# Altium schematic sheet PS2_Echo.SchDoc
size A4
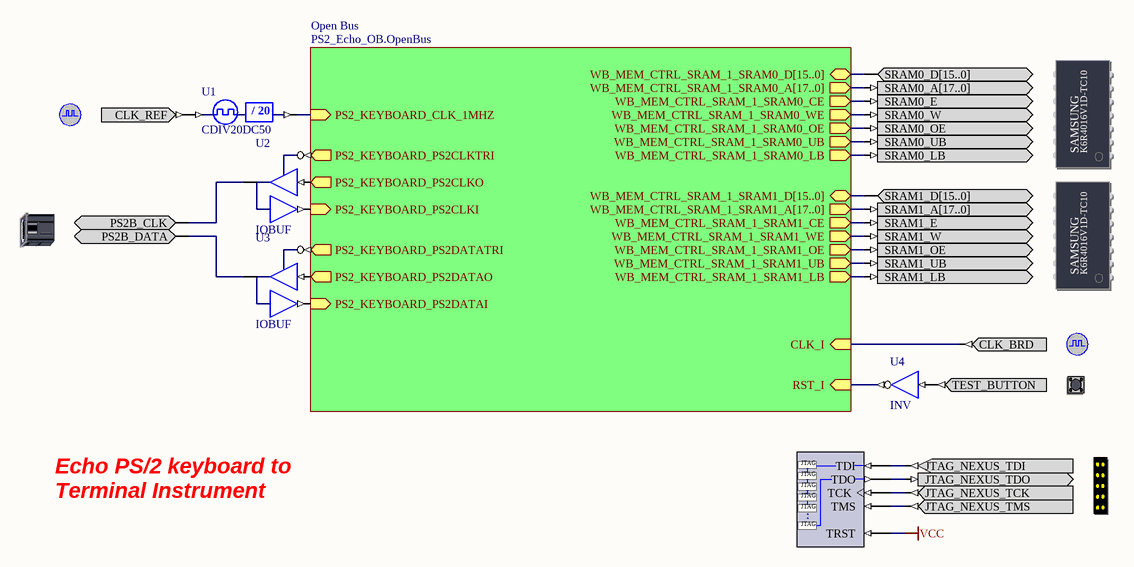
[diagram p0: PS2_Echo.SchDoc]

## Parts
(Parts that share a designator on the sheet are numbered #1, #2 ... from top to bottom, then left to right.)
?#1  SRAM_DAUGHTER0  (value not drawn)
?#2  CLOCK_REFERENCE  (value not drawn)
?#3  SRAM_DAUGHTER1  (value not drawn)
?#4  PS2B  (value not drawn)
?#5  CLOCK_BOARD  (value not drawn)
?#6  TEST_BUTTON  (value not drawn)
?#7  NEXUS_JTAG_CONNECTOR  (value not drawn)
NEXUS_JTAG_PORT  NEXUS_JTAG_PORT  (value not drawn)
U1  CDIV20DC50
U2  IOBUF
U3  IOBUF
U4  INV

## Sub-sheets
Open Bus = PS2_Echo_OB.OpenBus: WB_MEM_CTRL_SRAM_1_SRAM0_OE (out), WB_MEM_CTRL_SRAM_1_SRAM0_A[17..0] (out), WB_MEM_CTRL_SRAM_1_SRAM0_WE (out), WB_MEM_CTRL_SRAM_1_SRAM0_D[15..0] (bidir), WB_MEM_CTRL_SRAM_1_SRAM0_CE (out), WB_MEM_CTRL_SRAM_1_SRAM0_UB (out), WB_MEM_CTRL_SRAM_1_SRAM0_LB (out), WB_MEM_CTRL_SRAM_1_SRAM1_WE (out), WB_MEM_CTRL_SRAM_1_SRAM1_UB (out), WB_MEM_CTRL_SRAM_1_SRAM1_A[17..0] (out), WB_MEM_CTRL_SRAM_1_SRAM1_OE (out), WB_MEM_CTRL_SRAM_1_SRAM1_LB (out), WB_MEM_CTRL_SRAM_1_SRAM1_CE (out), WB_MEM_CTRL_SRAM_1_SRAM1_D[15..0] (bidir), RST_I (in), CLK_I (in), PS2_KEYBOARD_PS2CLKTRI (out), PS2_KEYBOARD_PS2DATAI (in), PS2_KEYBOARD_CLK_1MHZ (in), PS2_KEYBOARD_PS2DATAO (out), PS2_KEYBOARD_PS2CLKO (out), PS2_KEYBOARD_PS2CLKI (in), PS2_KEYBOARD_PS2DATATRI (out)

## Nets
VCC: NEXUS_JTAG_PORT.TRST
Net?#1_SRAM0_A[17..0]: ?#1.SRAM0_A[17..0] ; sheet Open Bus/WB_MEM_CTRL_SRAM_1_SRAM0_A[17..0]
Net?#1_SRAM0_D[15..0]: ?#1.SRAM0_D[15..0] ; sheet Open Bus/WB_MEM_CTRL_SRAM_1_SRAM0_D[15..0]
Net?#1_SRAM0_E: ?#1.SRAM0_E ; sheet Open Bus/WB_MEM_CTRL_SRAM_1_SRAM0_CE
Net?#1_SRAM0_LB: ?#1.SRAM0_LB ; sheet Open Bus/WB_MEM_CTRL_SRAM_1_SRAM0_LB
Net?#1_SRAM0_OE: ?#1.SRAM0_OE ; sheet Open Bus/WB_MEM_CTRL_SRAM_1_SRAM0_OE
Net?#1_SRAM0_UB: ?#1.SRAM0_UB ; sheet Open Bus/WB_MEM_CTRL_SRAM_1_SRAM0_UB
Net?#1_SRAM0_W: ?#1.SRAM0_W ; sheet Open Bus/WB_MEM_CTRL_SRAM_1_SRAM0_WE
Net?#2_CLK_REF: ?#2.CLK_REF U1.CLKIN
Net?#3_SRAM1_A[17..0]: ?#3.SRAM1_A[17..0] ; sheet Open Bus/WB_MEM_CTRL_SRAM_1_SRAM1_A[17..0]
Net?#3_SRAM1_D[15..0]: ?#3.SRAM1_D[15..0] ; sheet Open Bus/WB_MEM_CTRL_SRAM_1_SRAM1_D[15..0]
Net?#3_SRAM1_E: ?#3.SRAM1_E ; sheet Open Bus/WB_MEM_CTRL_SRAM_1_SRAM1_CE
Net?#3_SRAM1_LB: ?#3.SRAM1_LB ; sheet Open Bus/WB_MEM_CTRL_SRAM_1_SRAM1_LB
Net?#3_SRAM1_OE: ?#3.SRAM1_OE ; sheet Open Bus/WB_MEM_CTRL_SRAM_1_SRAM1_OE
Net?#3_SRAM1_UB: ?#3.SRAM1_UB ; sheet Open Bus/WB_MEM_CTRL_SRAM_1_SRAM1_UB
Net?#3_SRAM1_W: ?#3.SRAM1_W ; sheet Open Bus/WB_MEM_CTRL_SRAM_1_SRAM1_WE
Net?#4_PS2B_CLK: ?#4.PS2B_CLK U2.IO
Net?#4_PS2B_DATA: ?#4.PS2B_DATA U3.IO
Net?#5_CLK_BRD: ?#5.CLK_BRD ; sheet Open Bus/CLK_I
Net?#6_TEST_BUTTON: ?#6.TEST_BUTTON U4.I
Net?#7_JTAG_NEXUS_TCK: ?#7.JTAG_NEXUS_TCK NEXUS_JTAG_PORT.TCK
Net?#7_JTAG_NEXUS_TDI: ?#7.JTAG_NEXUS_TDI NEXUS_JTAG_PORT.TDI
Net?#7_JTAG_NEXUS_TDO: ?#7.JTAG_NEXUS_TDO NEXUS_JTAG_PORT.TDO
Net?#7_JTAG_NEXUS_TMS: ?#7.JTAG_NEXUS_TMS NEXUS_JTAG_PORT.TMS
NetU1_CLKDV: U1.CLKDV ; sheet Open Bus/PS2_KEYBOARD_CLK_1MHZ
NetU2_I: U2.I ; sheet Open Bus/PS2_KEYBOARD_PS2CLKO
NetU2_O: U2.O ; sheet Open Bus/PS2_KEYBOARD_PS2CLKI
NetU2_T: U2.T ; sheet Open Bus/PS2_KEYBOARD_PS2CLKTRI
NetU3_I: U3.I ; sheet Open Bus/PS2_KEYBOARD_PS2DATAO
NetU3_O: U3.O ; sheet Open Bus/PS2_KEYBOARD_PS2DATAI
NetU3_T: U3.T ; sheet Open Bus/PS2_KEYBOARD_PS2DATATRI
NetU4_O: U4.O ; sheet Open Bus/RST_I

## Notes on the sheet
- Echo PS/2 keyboard to Terminal Instrument
- (in symbol CDIV20DC50) / 20
- (in symbol NEXUS_JTAG_PORT) .
- (in symbol SRAM_DAUGHTER0) SAMSUNG; K6R4016V1D-TC10
- (in symbol SRAM_DAUGHTER1) SAMSUNG; K6R4016V1D-TC10

## Library data of the parts
?#1 = SRAM_DAUGHTER0: Free Static RAM - Daughterboard; PortComponent: True; Published: 14-May-2007; Publisher: Altium Limited; HelpURL: TR0149 Technical Reference for Altium's Xilinx Spartan-3 Daughter Board DB30.pdf#page=16
?#2 = CLOCK_REFERENCE: Global System Clock Reference Supply; PortComponent: True; Published: 19-Nov-2003; Publisher: Altium Limited; HelpURL: TR0143 Technical Reference Manual for Altium's Desktop NanoBoard NB2DSK01.pdf#page=41
?#3 = SRAM_DAUGHTER1: Free Static RAM - Daughterboard; PortComponent: True; Published: 14-May-2007; Publisher: Altium Limited; HelpURL: TR0149 Technical Reference for Altium's Xilinx Spartan-3 Daughter Board DB30.pdf#page=16
?#4 = PS2B: Key Board PS2 Connector; PortComponent: True; Published: 19-Nov-2003; Publisher: Altium Limited; HelpURL: TR0143 Technical Reference Manual for Altium's Desktop NanoBoard NB2DSK01.pdf#page=46
?#5 = CLOCK_BOARD: Global System Clock Supply; PortComponent: True; Published: 19-Nov-2003; Publisher: Altium Limited; HelpURL: TR0143 Technical Reference Manual for Altium's Desktop NanoBoard NB2DSK01.pdf#page=41; UseInDSF: True
?#6 = TEST_BUTTON: Test / Reset Button; PortComponent: True; Published: 19-Nov-2003; Publisher: Altium Limited; HelpURL: TR0143 Technical Reference Manual for Altium's Desktop NanoBoard NB2DSK01.pdf#page=53
?#7 = NEXUS_JTAG_CONNECTOR: JTAG Port; PortComponent: True; Published: 19-Nov-2003; Publisher: Altium Limited; HelpURL: TR0102 NanoBoard Technical Reference Manual - NB1.pdf#page=33
NEXUS_JTAG_PORT = NEXUS_JTAG_PORT: Soft Nexus-Chain Connector; NEXUS_JTAG_CONNECTOR: True; FunctionalClass: JTAG; Published: 29-Jan-2004; Publisher: Altium Limited; LastRevisionNo: 1.00.00; HelpURL: CR0118 FPGA Generic Library Guide.pdf#page=405
U1 = CDIV20DC50: Clock Divider by 20 with 50% Duty Cycle Output; DivisorRate: 20; DutyCycle: 50; ArchiveName: GENERIC; VHDLIB_SIM: GENERIC_LIB; Published: 29-Jan-2004; Publisher: Altium Limited; LastRevisionNo: 1.00.00; HelpURL: CR0118 FPGA Generic Library Guide.pdf#page=143; ComponentLink1URL: CR0127 FPGA Clock Divider Resource Usage.pdf#page=21; ComponentLink1Description: Core &Resource Usage; FunctionalClass: Clock Divider
U2 U3 = IOBUF: Input/Output Buffer; Enable: Low; Control: Common Control T; ArchiveName: GENERIC; VHDLIB_SIM: GENERIC_LIB; Published: 29-Jan-2004; Publisher: Altium Limited; XilinxEquivalent: IOBUF; LastRevisionNo: 1.00.00; HelpURL: CR0118 FPGA Generic Library Guide.pdf#page=293; ComponentLink1URL: CR0125 FPGA Buffer Resource Usage.pdf#page=78; ComponentLink1Description: Core &Resource Usage; FunctionalClass: Buffer; SubClass: IOBUF
U4 = INV: Inverter; FunctionalClass: Logic Primitive; ArchiveName: GENERIC; VHDLIB_SIM: GENERIC_LIB; Published: 29-Jan-2004; Publisher: Altium Limited; XilinxEquivalent: INV; LastRevisionNo: 1.00.00; HelpURL: CR0118 FPGA Generic Library Guide.pdf#page=291; ComponentLink1URL: CR0136 FPGA Logic Primitive Resource Usage.pdf#page=61; ComponentLink1Description: Core &Resource Usage; SubClass: INV